# EAGLE design UART_Block (EAGLE 6.6.0)

## Sheet 1 of 2
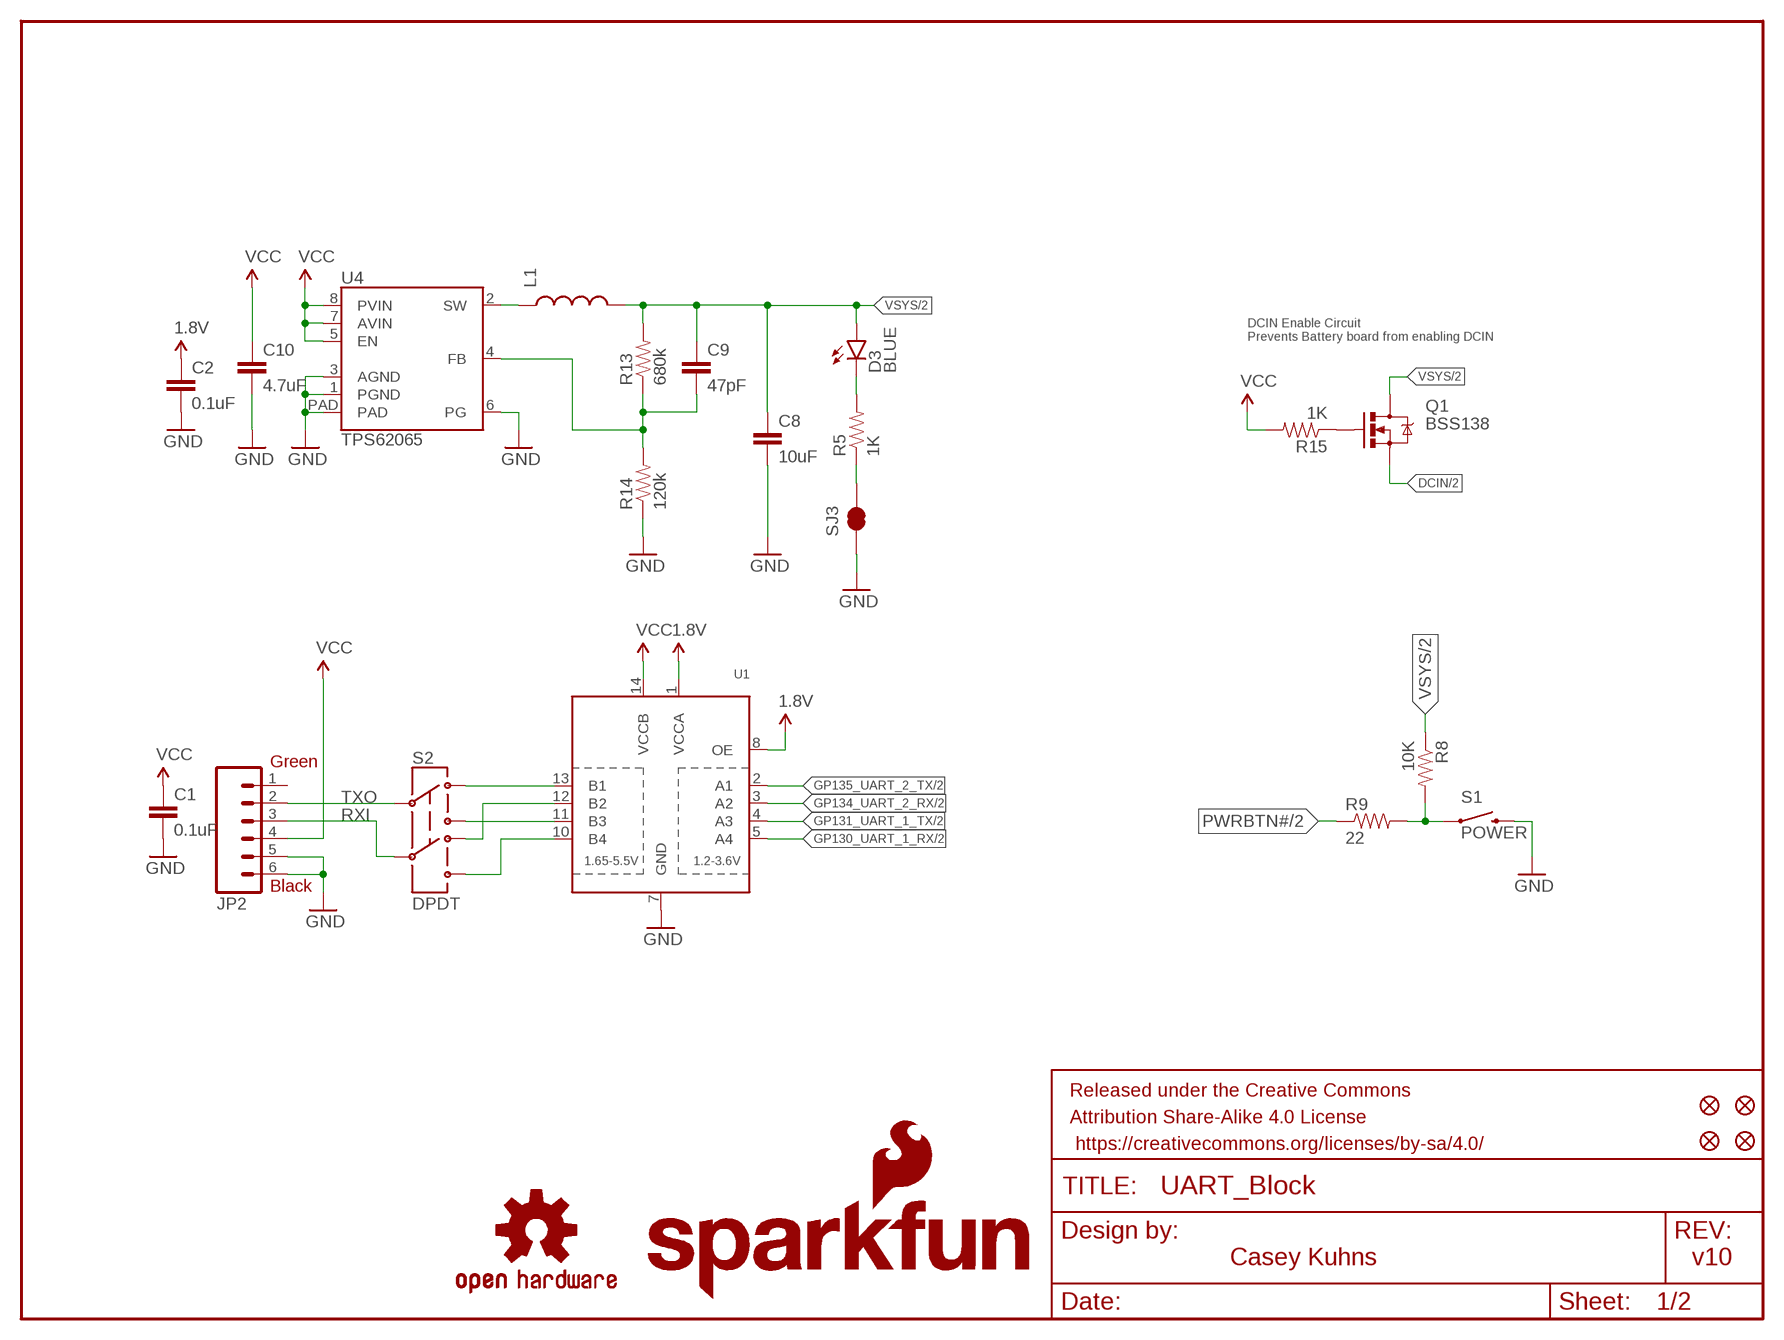
[diagram p0: schematic, sheet 1]

### Parts
C1  0.1uF  0.1UF-25V(+80/-20%)(0603)  [0603-CAP]
C2  0.1uF  0.1UF-25V(+80/-20%)(0603)  [0603-CAP]
C8  10uF  10UF-6.3V-20%(1206)  [1206]
C9  47pF  47PF-50V-5%(0603)  [0603-CAP]
C10  4.7uF  4.7UF-6.3V-10%(0603)0603  [0603-CAP]
D3  BLUE  LED-BLUE0603  [LED-0603]
FID1  FIDUCIAL1X2  [FIDUCIAL-1X2]
FID2  FIDUCIAL1X2  [FIDUCIAL-1X2]
FID3  FIDUCIAL1X2  [FIDUCIAL-1X2]
FID4  FIDUCIAL1X2  [FIDUCIAL-1X2]
FRAME1  FRAME-LETTER  [CREATIVE_COMMONS]
JP2  M06SMD  [1X06-SMD]
L1  INDUCTOR  [INDUCTOR-SRP4020]
LOGO1  SFE_LOGO_NAME_FLAME.1_INCH  [SFE_LOGO_NAME_FLAME_.1]
LOGO4  OSHW-LOGOS  [OSHW-LOGO-S]
Q1  BSS138  MOSFET-NCHANNELBSS138  [SOT23-3]
R5  1K  1KOHM1/10W1%(0603)  [0603-RES]
R8  10K  10KOHM1/10W1%(0603)0603  [0603-RES]
R9  22  22OHM1/10W1%(0603)  [0603-RES]
R13  680k  RESISTOR0603  [0603-RES]
R14  120k  RESISTOR0603  [0603-RES]
R15  1K  1KOHM1/10W1%(0603)  [0603-RES]
S1  POWER  SWITCH-MOMENTARY-2TACTILE-SWITCH-SMD-RIGHT-ANGLE  [TACTILE_SWITCH-SMD-RIGHT-ANGLE]
S2  DPDT  SWITCH-DPDTAYZ0202  [AYZ0202]
SJ3  JUMPER-PAD-2-NC_BY_TRACE  [PAD-JUMPER-2-NC_BY_TRACE_YES_SILK]
U1  TXB0104PWRSOIC14  [SO14]
U4  TPS62065  [WSON-8-PAD]

### Nets
1.8V: C2.1 U1.1(VCCA) U1.8(OE) ; also sheet 2
DCIN: Q1.2(S) ; also sheet 2
GND: C1.2 C2.2 C8.2 C10.2 JP2.5 JP2.6 R14.1 S1.2 SJ3.1 U1.7(GND) U4.1(PGND) U4.3(AGND) U4.6(PG) U4.PAD ; also sheet 2
GP130_UART_1_RX: U1.5(A4) ; also sheet 2
GP131_UART_1_TX: U1.4(A3) ; also sheet 2
GP134_UART_2_RX: U1.3(A2) ; also sheet 2
GP135_UART_2_TX: U1.2(A1) ; also sheet 2
N$1: Q1.1(G) R15.1
N$12: D3.C R5.2
N$13: R5.1 SJ3.2
N$15: R8.2 R9.2 S1.1
N$18: C9.2 R13.1 R14.2 U4.4(FB)
N$19: L1.P$1 U4.2(SW)
PWRBTN#: R9.1 ; also sheet 2
RXI: JP2.3 S2.5
TXO: JP2.2 S2.2
UART1RX: S2.6 U1.10(B4)
UART1TX: S2.3 U1.11(B3)
UART2RX: S2.4 U1.12(B2)
UART2TX: S2.1 U1.13(B1)
VCC: C1.1 C10.1 JP2.4 R15.2 U1.14(VCCB) U4.5(EN) U4.7(AVIN) U4.8(PVIN)
VSYS: C8.1 C9.1 D3.A L1.P$2 Q1.3(D) R8.1 R13.2 ; also sheet 2
Unconnected: JP2.1

### Notes on the sheet
- DCIN Enable Circuit
  Prevents Battery board from enabling DCIN
- Green
- Black
- Casey Kuhns | v10

## Sheet 2 of 2
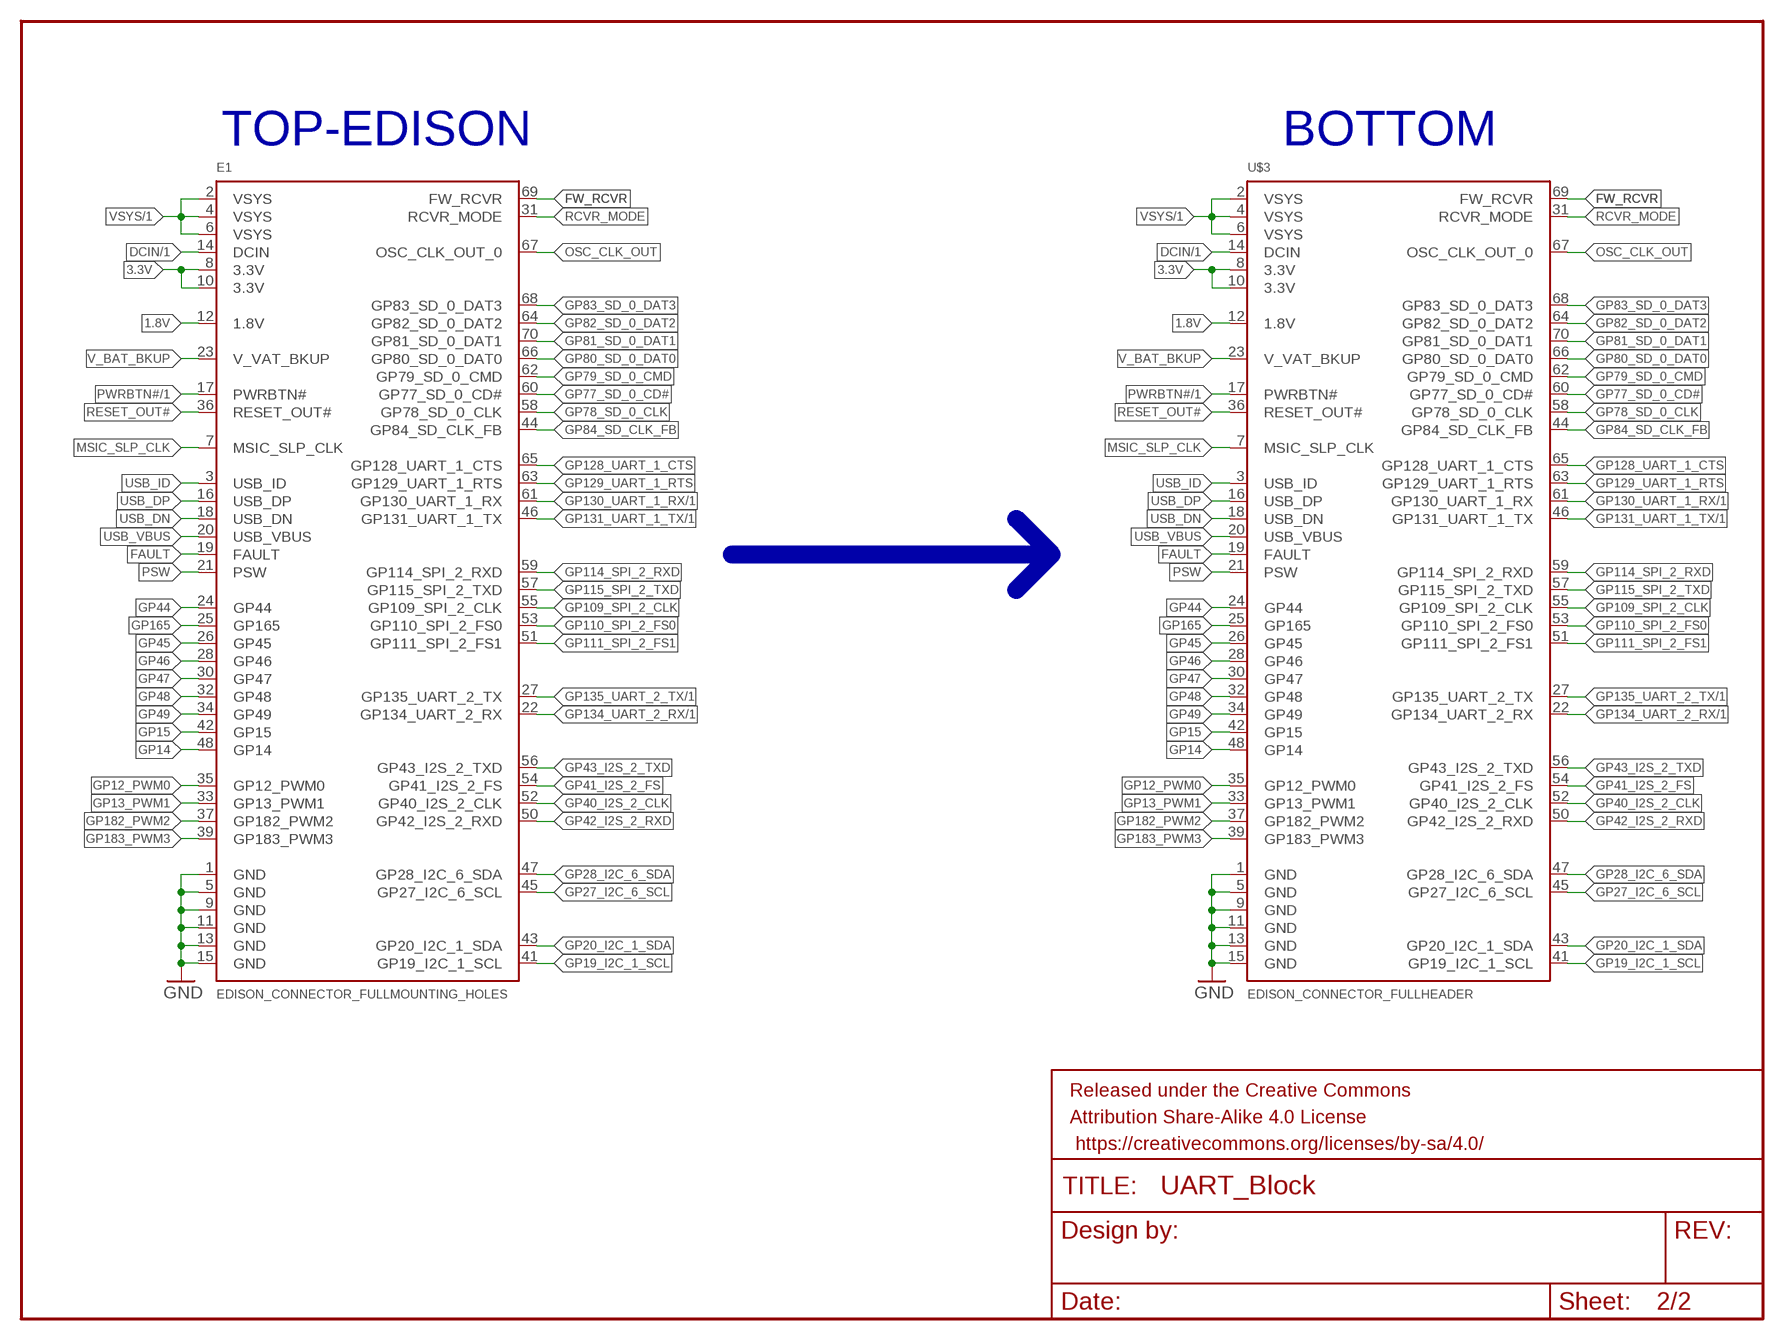
[diagram p1: schematic, sheet 2]

### Parts
E1  EDISON_CONNECTOR_FULLMOUNTING_HOLES  [EDISON_DAUGHTER]
FRAME2  FRAME-LETTER  [CREATIVE_COMMONS]
U$3  EDISON_CONNECTOR_FULLHEADER  [DF40C-70DP-0.4(51)]

### Nets
1.8V: E1.12(1.8V) U$3.12(1.8V) ; also sheet 1
3.3V: E1.8(3.3V) E1.10(3.3V) U$3.8(3.3V) U$3.10(3.3V)
DCIN: E1.14(DCIN) U$3.14(DCIN) ; also sheet 1
FAULT: E1.19(FAULT) U$3.19(FAULT)
FW_RCVR: E1.69(FW_RCVR) U$3.69(FW_RCVR)
GND: E1.1(GND) E1.5(GND) E1.9(GND) E1.11(GND) E1.13(GND) E1.15(GND) U$3.1(GND) U$3.5(GND) U$3.9(GND) U$3.11(GND) U$3.13(GND) U$3.15(GND) ; also sheet 1
GP12_PWM0: E1.35(GP12_PWM0) U$3.35(GP12_PWM0)
GP13_PWM1: E1.33(GP13_PWM1) U$3.33(GP13_PWM1)
GP14: E1.48(GP14) U$3.48(GP14)
GP15: E1.42(GP15) U$3.42(GP15)
GP19_I2C_1_SCL: E1.41(GP19_I2C_1_SCL) U$3.41(GP19_I2C_1_SCL)
GP20_I2C_1_SDA: E1.43(GP20_I2C_1_SDA) U$3.43(GP20_I2C_1_SDA)
GP27_I2C_6_SCL: E1.45(GP27_I2C_6_SCL) U$3.45(GP27_I2C_6_SCL)
GP28_I2C_6_SDA: E1.47(GP28_I2C_6_SDA) U$3.47(GP28_I2C_6_SDA)
GP40_I2S_2_CLK: E1.52(GP40_I2S_2_CLK) U$3.52(GP40_I2S_2_CLK)
GP41_I2S_2_FS: E1.54(GP41_I2S_2_FS) U$3.54(GP41_I2S_2_FS)
GP42_I2S_2_RXD: E1.50(GP42_I2S_2_RXD) U$3.50(GP42_I2S_2_RXD)
GP43_I2S_2_TXD: E1.56(GP43_I2S_2_TXD) U$3.56(GP43_I2S_2_TXD)
GP44: E1.24(GP44) U$3.24(GP44)
GP45: E1.26(GP45) U$3.26(GP45)
GP46: E1.28(GP46) U$3.28(GP46)
GP47: E1.30(GP47) U$3.30(GP47)
GP48: E1.32(GP48) U$3.32(GP48)
GP49: E1.34(GP49) U$3.34(GP49)
GP77_SD_0_CD#: E1.60(GP77_SD_0_CD#) U$3.60(GP77_SD_0_CD#)
GP78_SD_0_CLK: E1.58(GP78_SD_0_CLK) U$3.58(GP78_SD_0_CLK)
GP79_SD_0_CMD: E1.62(GP79_SD_0_CMD) U$3.62(GP79_SD_0_CMD)
GP80_SD_0_DAT0: E1.66(GP80_SD_0_DAT0) U$3.66(GP80_SD_0_DAT0)
GP81_SD_0_DAT1: E1.70(GP81_SD_0_DAT1) U$3.70(GP81_SD_0_DAT1)
GP82_SD_0_DAT2: E1.64(GP82_SD_0_DAT2) U$3.64(GP82_SD_0_DAT2)
GP83_SD_0_DAT3: E1.68(GP83_SD_0_DAT3) U$3.68(GP83_SD_0_DAT3)
GP84_SD_CLK_FB: E1.44(GP84_SD_CLK_FB) U$3.44(GP84_SD_CLK_FB)
GP109_SPI_2_CLK: E1.55(GP109_SPI_2_CLK) U$3.55(GP109_SPI_2_CLK)
GP110_SPI_2_FS0: E1.53(GP110_SPI_2_FS0) U$3.53(GP110_SPI_2_FS0)
GP111_SPI_2_FS1: E1.51(GP111_SPI_2_FS1) U$3.51(GP111_SPI_2_FS1)
GP114_SPI_2_RXD: E1.59(GP114_SPI_2_RXD) U$3.59(GP114_SPI_2_RXD)
GP115_SPI_2_TXD: E1.57(GP115_SPI_2_TXD) U$3.57(GP115_SPI_2_TXD)
GP128_UART_1_CTS: E1.65(GP128_UART_1_CTS) U$3.65(GP128_UART_1_CTS)
GP129_UART_1_RTS: E1.63(GP129_UART_1_RTS) U$3.63(GP129_UART_1_RTS)
GP130_UART_1_RX: E1.61(GP130_UART_1_RX) U$3.61(GP130_UART_1_RX) ; also sheet 1
GP131_UART_1_TX: E1.46(GP131_UART_1_TX) U$3.46(GP131_UART_1_TX) ; also sheet 1
GP134_UART_2_RX: E1.22(GP134_UART_2_RX) U$3.22(GP134_UART_2_RX) ; also sheet 1
GP135_UART_2_TX: E1.27(GP135_UART_2_TX) U$3.27(GP135_UART_2_TX) ; also sheet 1
GP165: E1.25(GP165) U$3.25(GP165)
GP182_PWM2: E1.37(GP182_PWM2) U$3.37(GP182_PWM2)
GP183_PWM3: E1.39(GP183_PWM3) U$3.39(GP183_PWM3)
MSIC_SLP_CLK: E1.7(MSIC_SLP_CLK) U$3.7(MSIC_SLP_CLK)
OSC_CLK_OUT: E1.67(OSC_CLK_OUT_0) U$3.67(OSC_CLK_OUT_0)
PSW: E1.21(PSW) U$3.21(PSW)
PWRBTN#: E1.17(PWRBTN#) U$3.17(PWRBTN#) ; also sheet 1
RCVR_MODE: E1.31(RCVR_MODE) U$3.31(RCVR_MODE)
RESET_OUT#: E1.36(RESET_OUT#) U$3.36(RESET_OUT#)
USB_DN: E1.18(USB_DN) U$3.18(USB_DN)
USB_DP: E1.16(USB_DP) U$3.16(USB_DP)
USB_ID: E1.3(USB_ID) U$3.3(USB_ID)
USB_VBUS: E1.20(USB_VBUS) U$3.20(USB_VBUS)
V_BAT_BKUP: E1.23(V_VAT_BKUP) U$3.23(V_VAT_BKUP)
VSYS: E1.2(VSYS) E1.4(VSYS) E1.6(VSYS) U$3.2(VSYS) U$3.4(VSYS) U$3.6(VSYS) ; also sheet 1

### Buses
B$1

### Notes on the sheet
- TOP-EDISON | BOTTOM

## Library data of the parts
C1 C2 = SparkFun-Capacitors:0.1UF-25V(+80/-20%)(0603): CAP-00810 Ceramic Standard decoupling cap; PROD_ID: CAP-00810
C8 = SparkFun-Capacitors:10UF-6.3V-20%(1206): CAP-10057 Ceramic; PROD_ID: CAP-10057
C9 = SparkFun-Capacitors:47PF-50V-5%(0603): CAP-08913; PROD_ID: CAP-08913
C10 = SparkFun-Capacitors:4.7UF-6.3V-10%(0603): CAP-08280; PROD_ID: CAP-08280
D3 = SparkFun-LED:LED-BLUE: Blue LEDs for production use Various blue LEDs stocked by SparkFun production 0603 - DIO-08575 Rebel - DIO-09553 1206 - DIO-09911; PROD_ID: DIO-08575
E1 U$3 = Edison:EDISON_CONNECTOR_FULL
FID1-FID4 = SparkFun-Aesthetics:FIDUCIAL: Fiducial Alignment Points Various fiducial points for machine vision alignment.
FRAME1 FRAME2 = SparkFun-Aesthetics:FRAME-LETTER: Schematic Frame Standard 8.5x11 US Letter frame
JP2 = SparkFun-Connectors:M06: Header 6 Standard 6-pin 0.1" header. Use with straight break away headers (SKU : PRT-00116), right angle break away headers (PRT-00553), swiss pins (PRT-00743), machine pins (PRT-00117), and female headers (PRT-00115). Molex polarized connector foot print use with SKU : PRT-08094 with associated crimp pins and housings. NOTES ON THE VARIANTS LOCK and LOCK_LONGPADS... This footprint was designed to help hold the alignment of a through-hole component (i.e. 6-pin header) while soldering it into place. You may notice that each hole has been shifted either up or down by 0.005 of an inch from it's more standard position (which is a perfectly straight line). This slight alteration caused the pins (the squares in the middle) to touch the edges of the holes. Because they are alternating, it causes a "brace" to hold the component in place. 0.005 has proven to be the perfect amount of "off-center" position when using our standard breakaway headers. Although looks a little odd when you look at the bare footprint, once you have a header in there, the alteration is very hard to notice. Also,if you push a header all the way into place, it is covered up entirely on the bottom side. This idea of altering the position of holes to aid alignment will be further integrated into the Sparkfun Library for other footprints. It can help hold any component with 3 or more connection pins.
L1 = SparkFun-Passives:INDUCTOR: Inductors Basic Inductor/Choke - 0603 and 1206. Footprints are not proven and vary greatly between part numbers. SRN6045- 33uH, 20% 1.4A SDR0403-560KL - 56uH, 10%, 500mA RMS/740mA peak
LOGO1 = SparkFun-Aesthetics:SFE_LOGO_NAME_FLAME: SFE Logo, name and flame This is the SparkFun full logo. The logo on the schematic will always be the same size; the package variant is the height of the flame part of the logo. Default layer for the logo on the board is tSilk.
LOGO4 = SparkFun-Aesthetics:OSHW-LOGO: Open Source Hardware Logo This logo indicates the piece of hardware it is found on incorporates a OSHW license and/or adheres to the definition of open source hardware found here: http://freedomdefined.org/OSHW
Q1 = SparkFun-DiscreteSemi:MOSFET-NCHANNEL: Common NMOSFET Parts MFG P/N Store ID Prod ID FDD8780 TRANS-09984 SI7820DN TRANS-11055 FDS6630A IC-08089 2N7002PW TRANS-11151 FQP30N06L COM-10213 TRANS-10060 BSS123LT1G TRANS-08345 BSS138 TRANS-00830 BS170 2N7000; PROD_ID: TRANS-00830
R5 R15 = SparkFun-Resistors:1KOHM1/10W1%(0603): RES-07856; PROD_ID: RES-07856
R8 = SparkFun-Resistors:10KOHM1/10W1%(0603): RES-00824; PROD_ID: RES-00824
R9 = SparkFun-Resistors:22OHM1/10W1%(0603): RES-08698; PROD_ID: RES-08698
R13 R14 = SparkFun-Resistors:RESISTOR: Resistor Basic schematic elements and footprints for 0603, 1206, and PTH resistors.
S1 = SparkFun-Electromechanical:SWITCH-MOMENTARY-2: Various NO switches- pushbuttons, reed, etc; PROD_ID: COMP-12265
S2 = SparkFun-Electromechanical:SWITCH-DPDT: DPDT Version of the COM-00597; PROD_ID: SWCH-08179
SJ3 = SparkFun-Passives:JUMPER-PAD-2-NC_BY_TRACE
U1 = SparkFun-DigitalIC:TXB0104PWR: 4-Bit Bi-Directional Level Shifter 1.2V-3.6V (VCCA) to 1.65V-5.5V (VCCB) bi-directional level shifter with auto direction sensing. Max data rate - VCCA 1.8V: 20Mbps (50ns), VCCA 3.3V: 100Mbps (10ns) Digikey: 296-21929-1-ND (TSSOP) IC-11329; PROD_ID: IC-11329
U4 = Testing:TPS62065: Texas Instruments TPS62172 3-17V 0.5A Step-Down Converter with DCS control. Available in adjustable and fixed output voltage versions. Is packaged in an 8-pin WSON package measuring 2 × 2 mm (DSG). See a 3.3V fixed output version of this chip in action on the Electric Imp Breakout Board <https://www.sparkfun.com/products/11400>. Datasheet <http://www.ti.com/lit/gpn/tps62172>

## Board
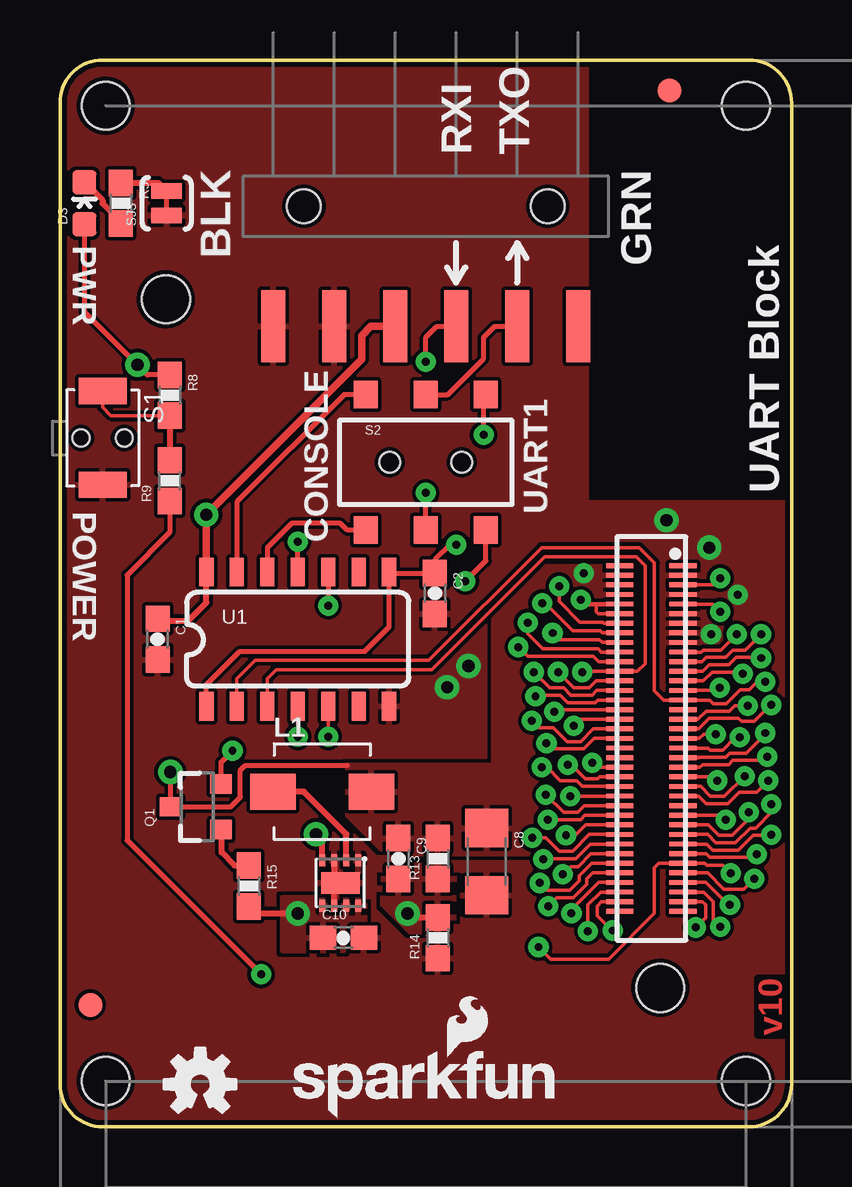
[diagram p2: board, top side]
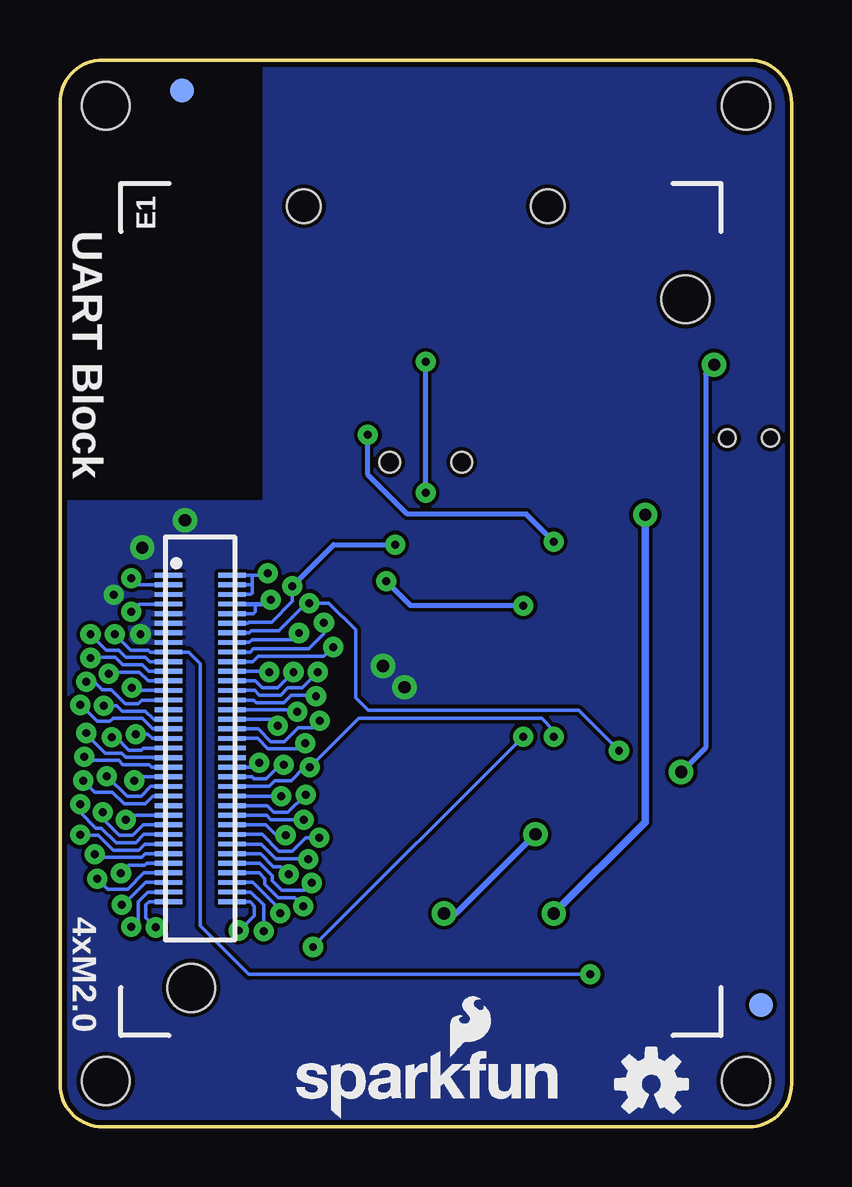
[diagram p3: board, bottom side, seen from below]

Size 30.48 x 44.45 mm. Coordinates in mm from the lower left corner, seen from the top.
Outline: 30.48,42.67 30.48,1.78 arc-90 28.7,0 1.78,0 arc-90 0,1.78 0,42.67 arc-90 1.78,44.45 28.7,44.45 arc-90 30.48,42.67
Copper layers (1*16): Top 0.035mm / dielectric 1.5mm / Bottom 0.035mm
Design rules "SparkFun-2-layer *": minimum track width 6mil, minimum drill 13mil, track to track 6mil, track to pad 6mil, pad to pad 6mil, via to via 6mil, smd to smd 6mil, copper to edge 8mil, drill to drill 8mil, minimum pad ring 12mil, minimum via ring 10mil, stop-mask expansion 4mil, vias tented up to drill 20mil, thermal gap 6mil
Holes 2 mm at 28.57,1.91 1.91,1.91 1.91,42.55 28.57,42.55
tRestrict: area 22.1,26.2 to 30.5,44.5; 3 lines
bRestrict: area 22.1,26.2 to 30.5,44.5

### Footprints (pad centres in the part's own frame; a part is rotated, then mirrored left to right if it is on the bottom)
0603-CAP = smd 1.1 x 1: 1 -0.85,0; 2 0.85,0
1206 = smd 1.6 x 1.8: 1 -1.4,0; 2 1.4,0
LED-0603 = smd 1 x 1: A 0,-0.877; C 0,0.877
EDISON_DAUGHTER = smd 1.14 x 0.2: 1 1.98,19.17; 2 4.62,19.17; 3 1.98,18.77; 4 4.62,18.77; 5 1.98,18.37; 6 4.62,18.37; 7 1.98,17.97; 8 4.62,17.97; 9 1.98,17.57; 10 4.62,17.57; 11 1.98,17.17; 12 4.62,17.17; 13 1.98,16.77; 14 4.62,16.77; 15 1.98,16.37; 16 4.62,16.37; 17 1.98,15.97; 18 4.62,15.97; 19 1.98,15.57; 20 4.62,15.57; 21 1.98,15.17; 22 4.62,15.17; 23 1.98,14.77; 24 4.62,14.77; 25 1.98,14.37; 26 4.62,14.37; 27 1.98,13.97; 28 4.62,13.97; 29 1.98,13.57; 30 4.62,13.57; 31 1.98,13.17; 32 4.62,13.17; 33 1.98,12.77; 34 4.62,12.77; 35 1.98,12.37; 36 4.62,12.37; 37 1.98,11.97; 38 4.62,11.97; 39 1.98,11.57; 40 4.62,11.57; 41 1.98,11.17; 42 4.62,11.17; 43 1.98,10.77; 44 4.62,10.77; 45 1.98,10.37; 46 4.62,10.37; 47 1.98,9.97; 48 4.62,9.97; 49 1.98,9.57; 50 4.62,9.57; 51 1.98,9.17; 52 4.62,9.17; 53 1.98,8.77; 54 4.62,8.77; 55 1.98,8.37; 56 4.62,8.37; 57 1.98,7.97; 58 4.62,7.97; 59 1.98,7.57; 60 4.62,7.57; 61 1.98,7.17; 62 4.62,7.17; 63 1.98,6.77; 64 4.62,6.77; 65 1.98,6.37; 66 4.62,6.37; 67 1.98,5.97; 68 4.62,5.97; 69 1.98,5.57; 70 4.62,5.57 | hole 2: 23.53,30.67; 2.93,1.98
FIDUCIAL-1X2 = smd 1 x 1: 1 0,0
1X06-SMD = smd 1 x 3: 1 -6.35,5; 2 -3.81,5; 3 -1.27,5; 4 1.27,5; 5 3.81,5; 6 6.35,5 | hole 1.4: -5.08,0; 5.08,0
INDUCTOR-SRP4020 = smd 1.9 x 1.5: P$1 -2.05,0; P$2 2.05,0
SOT23-3 = smd 0.8 x 0.9: 1 -0.95,-1; 2 0.95,-1; 3 0,1.1
0603-RES = smd 1.1 x 1: 1 -0.85,0; 2 0.85,0
TACTILE_SWITCH-SMD-RIGHT-ANGLE = smd 1.1 x 2: 1 -1.95,0; 2 1.95,0 | hole 0.7: 0,0.9; 0,-0.9
AYZ0202 = smd 1 x 1.15: 1 -2.5,2.825; 2 0,2.825; 3 2.5,2.825; 4 -2.5,-2.825; 5 0,-2.825; 6 2.5,-2.825 | hole 0.85: 1.5,0; -1.5,0
PAD-JUMPER-2-NC_BY_TRACE_YES_SILK = smd 0.635 x 1.27: 1 -0.508,0; 2 0.508,0
SO14 = smd 0.6 x 1.2: 1 -3.81,-2.8; 2 -2.54,-2.8; 3 -1.27,-2.8; 4 0,-2.8; 5 1.27,-2.8; 6 2.54,-2.8; 7 3.81,-2.8; 8 3.81,2.8; 9 2.54,2.8; 10 1.27,2.8; 11 0,2.8; 12 -1.27,2.8; 13 -2.54,2.8; 14 -3.81,2.8
WSON-8-PAD = smd 0.25 x 0.5: 1 -0.75,-0.95; 2 -0.25,-0.95; 3 0.25,-0.95; 4 0.75,-0.95; 5 0.75,0.95; 6 0.25,0.95; 7 -0.25,0.95; 8 -0.75,0.95 | smd 1.6 x 0.9: PAD 0,0
DF40C-70DP-0.4(51) = smd 0.2 x 1.14 bottom: 1 6.8,1.32; 2 6.8,-1.32; 3 6.4,1.32; 4 6.4,-1.32; 5 6,1.32; 6 6,-1.32; 7 5.6,1.32; 8 5.6,-1.32; 9 5.2,1.32; 10 5.2,-1.32; 11 4.8,1.32; 12 4.8,-1.32; 13 4.4,1.32; 14 4.4,-1.32; 15 4,1.32; 16 4,-1.32; 17 3.6,1.32; 18 3.6,-1.32; 19 3.2,1.32; 20 3.2,-1.32; 21 2.8,1.32; 22 2.8,-1.32; 23 2.4,1.32; 24 2.4,-1.32; 25 2,1.32; 26 2,-1.32; 27 1.6,1.32; 28 1.6,-1.32; 29 1.2,1.32; 30 1.2,-1.32; 31 0.8,1.32; 32 0.8,-1.32; 33 0.4,1.32; 34 0.4,-1.32; 35 0,1.32; 36 0,-1.32; 37 -0.4,1.32; 38 -0.4,-1.32; 39 -0.8,1.32; 40 -0.8,-1.32; 41 -1.2,1.32; 42 -1.2,-1.32; 43 -1.6,1.32; 44 -1.6,-1.32; 45 -2,1.32; 46 -2,-1.32; 47 -2.4,1.32; 48 -2.4,-1.32; 49 -2.8,1.32; 50 -2.8,-1.32; 51 -3.2,1.32; 52 -3.2,-1.32; 53 -3.6,1.32; 54 -3.6,-1.32; 55 -4,1.32; 56 -4,-1.32; 57 -4.4,1.32; 58 -4.4,-1.32; 59 -4.8,1.32; 60 -4.8,-1.32; 61 -5.2,1.32; 62 -5.2,-1.32; 63 -5.6,1.32; 64 -5.6,-1.32; 65 -6,1.32; 66 -6,-1.32; 67 -6.4,1.32; 68 -6.4,-1.32; 69 -6.8,1.32; 70 -6.8,-1.32; NC1 7.2,1.32; NC2 7.2,-1.32; NC3 -7.2,-1.32; NC4 -7.2,1.32

### Placement (x,y rotation side)
C1  4.06,20.32 270 top
C2  15.62,22.23 270 top
C8  17.78,11.05 270 top
C9  14.1,11.18 270 top
C10  11.81,7.87 0 top
D3  1.02,38.48 0 top
E1  27.94,3.81 0 bottom
FID1  25.4,43.18 0 top
FID2  1.27,5.08 0 top
FID3  1.27,5.08 0 bottom
FID4  25.4,43.18 0 bottom
FRAME1  -1.27,-13.97 0 top  (outside the outline)
FRAME2  -1.27,-13.97 0 top  (outside the outline)
JP2  15.24,38.35 180 top
L1  10.92,13.97 0 top
LOGO1  9.27,0.25 0 top
LOGO2  OSHW-LOGOS  [OSHW-LOGO-S]  5.84,1.78 0 bottom
LOGO3  SFE_LOGO_NAME_FLAME.1_INCH  [SFE_LOGO_NAME_FLAME_.1]  21.08,0.25 0 bottom
LOGO4  5.84,1.78 0 top
Q1  5.71,13.34 90 top
R5  2.54,38.48 270 top
R8  4.57,30.48 270 top
R9  4.57,26.92 90 top
R13  15.75,11.18 90 top
R14  15.75,7.87 90 top
R15  7.87,10.03 270 top
S1  1.78,28.7 270 top
S2  15.24,27.69 0 top
SJ3  4.45,38.48 90 top
U1  9.91,20.32 0 top
U4  11.68,10.16 180 top
U$3  24.64,16.18 90 bottom

### Tracks (layer width: path | path; a pad name or v marks a point on that pad's centre or on a via)
1.8V  (via drill 0.33)
  Top 0.152: U$3.12 22.66,20.98 22.61,21.03 21.67,21.03 20.8,21.89 v20.8,22.53
  Top 0.203: U1.1 6.1,18.41 7.49,19.81 12.7,19.81 13.72,20.83 U1.8 13.76,23.07 C2.1 15.62,23.62 16.26,24.26 v16.51,24.26
  Bottom 0.152: U$3.12 | v20.8,22.53 20.8,21.89 21.67,21.03 22.61,21.03 22.66,20.98 U$3.12
  Bottom 0.203: v16.51,24.26 19.07,24.26 v20.8,22.53
3.3V  (via drill 0.33)
  Top 0.152: U$3.10 22.43,21.38 22.35,21.46 22.35,21.78
  Top 0.178: v21.7,21.96 21.88,21.78 22.35,21.78 U$3.8
  Bottom 0.152: U$3.10 22.43,21.38 22.35,21.46 22.35,21.78 | U$3.8
  Bottom 0.178: U$3.8 22.35,21.78 21.88,21.78 v21.7,21.96
DCIN  (via drill 0.33)
  Top 0.152: E1.14 22.6,20.58 22.5,20.68 21.36,20.68 20.22,21.82 v20.09,21.82
  Top 0.203: Q1.2 6.71,15.2 v7.19,15.67
  Bottom 0.152: E1.14 22.6,20.58 22.5,20.68 21.36,20.68 20.22,21.82 v20.09,21.82 19.28,21.82 18.16,20.7 18.16,17.88 17.63,17.35 8.87,17.35 v7.19,15.67
FAULT  (via drill 0.33)
  Top 0.152: U$3.19 26.75,19.38 26.92,19.56 27.74,19.56 28.04,19.86 28.55,19.86 v29.21,20.52
  Bottom 0.152: v29.21,20.52 28.55,19.86 28.04,19.86 27.74,19.56 26.92,19.56 26.75,19.38 U$3.19
FW_RCVR  (via drill 0.33)
  Top 0.152: v26.49,8.31 26.9,8.71 26.9,9.25 26.76,9.38 U$3.69
  Bottom 0.152: U$3.69 26.76,9.38 26.9,9.25 26.9,8.71 v26.49,8.31
GND  (via drill 0.33, 0.51)
  Top 0.254: U4.6 11.43,9.91 U4.PAD 11.43,10.16 U4.3
  other vias: 27.13,20.52 28.24,22.17 27.05,24.13 25.27,25.27 17.02,19.2 16.13,18.31
  pour Bottom (isolate 0.051, rank 6): 30.48,42.67 30.48,1.78 arc-90 28.7,0 1.78,0 arc-90 0,1.78 0,42.67 arc-90 1.78,44.45 28.7,44.45 arc-90
  pour Top (isolate 0.051, rank 6): 30.48,1.73 arc-90 28.75,0 1.78,0 arc-90 0,1.78 0,42.67 arc-90 1.78,44.45 28.7,44.45 arc-90 30.48,42.67
GP12_PWM0  (via drill 0.33)
  Top 0.152: U$3.35 26.64,16.18 26.82,16.36 v27.33,16.36
  Bottom 0.152: v27.33,16.36 26.82,16.36 26.64,16.18 U$3.35 | U$3.35
GP13_PWM1  (via drill 0.33)
  Top 0.152: v29.64,17.58 29.62,17.58 28.93,16.89 28.4,16.89 28.27,17.02 27.05,17.02 26.61,16.58 U$3.33
  Bottom 0.152: U$3.33 26.61,16.58 27.05,17.02 28.27,17.02 28.4,16.89 28.93,16.89 29.62,17.58 v29.64,17.58
GP14  (via drill 0.33)
  Top 0.152: v21.26,13.77 21.27,13.78 U$3.48
  Bottom 0.152: U$3.48 21.27,13.78 v21.26,13.77
GP15  (via drill 0.33)
  Top 0.152: U$3.42 22.36,14.98 v22.17,15.16
  Bottom 0.152: v22.17,15.16 22.36,14.98 U$3.42
GP19_I2C_1_SCL  (via drill 0.33)
  Top 0.152: U$3.41 26.66,14.98 26.77,15.09 27.86,15.09 28.04,15.27 29.31,15.27 v29.46,15.42
  Bottom 0.152: v29.46,15.42 29.31,15.27 28.04,15.27 27.86,15.09 26.77,15.09 26.66,14.98 U$3.41
GP20_I2C_1_SDA  (via drill 0.33)
  Top 0.152: U$3.43 27.23,14.58 v27.38,14.43
  Bottom 0.152: v27.38,14.43 27.23,14.58 U$3.43 | U$3.43
GP27_I2C_6_SCL  (via drill 0.33)
  Top 0.152: v28.52,14.61 27.69,13.77 27.1,13.77 26.69,14.18 U$3.45
  Bottom 0.152: U$3.45 26.69,14.18 27.1,13.77 27.69,13.77 v28.52,14.61
GP28_I2C_6_SDA  (via drill 0.33)
  Top 0.152: U$3.47 26.61,13.78 26.92,13.46 27.81,13.46 28.3,13.95 29.03,13.95 v29.52,14.43
  Bottom 0.152: v29.52,14.43 29.03,13.95 28.3,13.95 27.81,13.46 26.92,13.46 26.61,13.78 U$3.47
GP40_I2S_2_CLK  (via drill 0.33)
  Top 0.152: U$3.52 21.87,12.98 21.69,12.8 v20.32,12.8
  Bottom 0.152: v20.32,12.8 21.69,12.8 21.87,12.98 U$3.52
GP41_I2S_2_FS  (via drill 0.33)
  Top 0.152: v21.08,12.14 21.46,12.14 21.9,12.58 U$3.54
  Bottom 0.152: U$3.54 21.9,12.58 21.46,12.14 v21.08,12.14
GP42_I2S_2_RXD  (via drill 0.33)
  Top 0.152: U$3.50 21.84,13.38 21.57,13.11 20.98,13.11 v20.24,13.84
  Bottom 0.152: v20.24,13.84 20.98,13.11 21.57,13.11 21.84,13.38 U$3.50
GP43_I2S_2_TXD  (via drill 0.33)
  Top 0.152: U$3.56 22.06,12.18 21.36,11.48 20.8,11.48 20.24,12.04 v19.68,12.04
  Bottom 0.152: v19.68,12.04 20.24,12.04 20.8,11.48 21.36,11.48 22.06,12.18 U$3.56
GP44  (via drill 0.33)
  Top 0.152: U$3.24 22.34,18.58 22.05,18.29 21.41,18.29 v20.75,18.95
  Bottom 0.152: v20.75,18.95 21.41,18.29 22.05,18.29 22.34,18.58 U$3.24
GP45  (via drill 0.33)
  Top 0.152: v19.74,18.95 20.4,18.29 20.98,18.29 21.29,17.98 22.17,17.98 22.37,18.18 U$3.26
  Bottom 0.152: U$3.26 22.37,18.18 22.17,17.98 21.29,17.98 20.98,18.29 20.4,18.29 v19.74,18.95
GP46  (via drill 0.33)
  Top 0.152: U$3.28 22.4,17.78 22.3,17.68 21.16,17.68 20.85,17.98 19.86,17.98 v19.81,17.93
  Bottom 0.152: v19.81,17.93 19.86,17.98 20.85,17.98 21.16,17.68 22.3,17.68 22.4,17.78 U$3.28
GP47  (via drill 0.33)
  Top 0.152: U$3.30 22.43,17.38 22.43,17.37 20.68,17.37 v20.6,17.3
  Bottom 0.152: v20.6,17.3 20.68,17.37 22.43,17.37 22.43,17.38 U$3.30
GP48  (via drill 0.33)
  Top 0.152: v21.41,16.71 21.68,16.98 U$3.32
  Bottom 0.152: U$3.32 21.68,16.98 v21.41,16.71
GP49  (via drill 0.33)
  Top 0.152: U$3.34 22.22,16.58 21.69,16.05 21.13,16.05 20.55,16.64 19.94,16.64 v19.66,16.92
  Bottom 0.152: v19.66,16.92 19.94,16.64 20.55,16.64 21.13,16.05 21.69,16.05 22.22,16.58 U$3.34
GP77_SD_0_CD#  (via drill 0.33)
  Top 0.152: U$3.60 22.12,11.38 21.59,10.85 21.29,10.85 v20.95,10.52
  Bottom 0.152: v20.95,10.52 21.29,10.85 21.59,10.85 22.12,11.38 U$3.60
GP78_SD_0_CLK  (via drill 0.33)
  Top 0.152: U$3.58 22.09,11.78 21.49,11.18 20.17,11.18 v20.14,11.15
  Bottom 0.152: v20.14,11.15 20.17,11.18 21.49,11.18 22.09,11.78 U$3.58
GP79_SD_0_CMD  (via drill 0.33)
  Top 0.152: U$3.62 22.16,10.98 21.64,10.46 21.64,10.26 21.23,9.86 20.3,9.86 v19.99,10.16
  Bottom 0.152: v19.99,10.16 20.3,9.86 21.23,9.86 21.64,10.26 21.64,10.46 22.16,10.98 U$3.62
GP80_SD_0_DAT0  (via drill 0.33)
  Top 0.152: v21.31,8.89 21.31,9.04 22.45,10.18 U$3.66
  Bottom 0.152: U$3.66 22.45,10.18 21.31,9.04 v21.31,8.89
GP81_SD_0_DAT1  (via drill 0.33)
  Top 0.152: U$3.70 22.56,9.38 22.38,9.2 22.38,8.79 22.99,8.18 v23.04,8.18
  Bottom 0.152: v23.04,8.18 22.99,8.18 22.38,8.79 22.38,9.2 22.56,9.38 U$3.70
GP82_SD_0_DAT2  (via drill 0.33)
  Top 0.152: U$3.64 22.19,10.58 21.95,10.34 21.95,10.11 21.39,9.55 20.7,9.55 v20.34,9.2
  Bottom 0.152: v20.34,9.2 20.7,9.55 21.39,9.55 21.95,10.11 21.95,10.34 22.19,10.58 U$3.64
GP83_SD_0_DAT3  (via drill 0.33)
  Top 0.152: v22,8.15 22,9.25 22.53,9.78 U$3.68
  Bottom 0.152: U$3.68 22.53,9.78 22,9.25 v22,8.15
GP84_SD_CLK_FB  (via drill 0.33)
  Top 0.152: U$3.44 22.48,14.58 22.4,14.5 21.89,14.5 21.31,15.09 v21.16,15.09
  Bottom 0.152: v21.16,15.09 21.31,15.09 21.89,14.5 22.4,14.5 22.48,14.58 U$3.44 | U$3.44
GP109_SPI_2_CLK  (via drill 0.33)
  Top 0.152: U$3.55 26.99,12.18 27.33,11.84 28.14,11.84 28.75,12.45 28.98,12.45 29.64,13.11 v29.64,13.44
  Bottom 0.152: v29.64,13.44 29.64,13.11 28.98,12.45 28.75,12.45 28.14,11.84 27.33,11.84 26.99,12.18 U$3.55
GP110_SPI_2_FS0  (via drill 0.33)
  Top 0.152: v28.7,13.11 28.7,12.83 28.02,12.14 27.46,12.14 27.02,12.58 U$3.53
  Bottom 0.152: U$3.53 27.02,12.58 27.46,12.14 28.02,12.14 28.7,12.83 v28.7,13.11
GP111_SPI_2_FS1  (via drill 0.33)
  Top 0.152: v27.74,12.8 27.56,12.98 U$3.51
  Bottom 0.152: U$3.51 27.56,12.98 v27.74,12.8
GP114_SPI_2_RXD  (via drill 0.33)
  Top 0.152: U$3.59 26.92,11.38 27.08,11.23 28.91,11.23 v29.03,11.35
  Bottom 0.152: U$3.59 26.92,11.38 27.08,11.23 28.91,11.23 v29.03,11.35
GP115_SPI_2_TXD  (via drill 0.33)
  Top 0.152: U$3.57 26.95,11.78 27.2,11.53 28.27,11.53 28.88,12.14 29.62,12.14 v29.64,12.17
  Bottom 0.152: U$3.57 26.95,11.78 27.2,11.53 28.27,11.53 28.88,12.14 29.62,12.14 v29.64,12.17
GP128_UART_1_CTS  (via drill 0.33)
  Top 0.152: U$3.65 26.9,10.18 27.84,9.25 v27.91,9.25
  Bottom 0.152: v27.91,9.25 27.84,9.25 26.9,10.18 U$3.65
GP129_UART_1_RTS  (via drill 0.33)
  Top 0.152: v28.93,10.34 28.5,9.91 27.66,9.91 26.99,10.58 U$3.63
  Bottom 0.152: U$3.63 26.99,10.58 27.66,9.91 28.5,9.91 v28.93,10.34
GP130_UART_1_RX  (via drill 0.33)
  Top 0.152: v27.94,10.57 27.61,10.9 26.95,10.9 26.87,10.98 U$3.61 24.95,10.98 24.77,10.79 24.77,8.89 22.86,6.99 20.45,6.99 v19.94,7.49 | v11.18,16.26 U1.5
  Bottom 0.152: U$3.61 26.87,10.98 26.95,10.9 27.61,10.9 v27.94,10.57 | v19.94,7.49 v11.18,16.26
GP131_UART_1_TX  (via drill 0.33)
  Top 0.152: U$3.46 22.52,14.18 22.5,14.2 21.77,14.2 21.54,14.43 20.85,14.43 20.3,14.99 v20.07,14.99 | v9.91,16.26 U1.4
  Bottom 0.152: U$3.46 22.52,14.18 22.5,14.2 21.77,14.2 21.54,14.43 20.85,14.43 20.3,14.99 v20.07,14.99 18.03,17.02 10.41,17.02 9.91,16.51 v9.91,16.26
GP134_UART_2_RX  (via drill 0.33)
  Top 0.152: v21.77,18.95 21.8,18.98 U$3.22 24.06,18.98 24.38,19.3 24.38,23.37 24,23.75 20.19,23.75 15.49,19.05 9.02,19.05 8.64,18.67 U1.3
  Bottom 0.152: U$3.22 21.8,18.98 v21.77,18.95
GP135_UART_2_TX  (via drill 0.33)
  Top 0.152: v29.39,18.54 29.06,18.54 28.73,18.21 28.35,18.21 27.76,17.63 27.23,17.63 27.08,17.78 U$3.27 25.15,17.78 24.77,18.16 24.77,23.5 24.13,24.13 20.07,24.13 15.37,19.43 8.13,19.43 7.37,18.67 U1.2
  Bottom 0.152: U$3.27 27.08,17.78 27.23,17.63 27.76,17.63 28.35,18.21 28.73,18.21 29.06,18.54 v29.39,18.54
GP165  (via drill 0.33)
  Top 0.152: v27.48,18.29 27.38,18.18 U$3.25
  Bottom 0.152: U$3.25 27.38,18.18 v27.48,18.29
GP182_PWM2  (via drill 0.33)
  Top 0.152: U$3.37 27.02,15.78 27.1,15.7 27.61,15.7 28.14,16.23 v28.32,16.23
  Bottom 0.152: v28.32,16.23 28.14,16.23 27.61,15.7 27.1,15.7 27.02,15.78 U$3.37
GP183_PWM3  (via drill 0.33)
  Top 0.152: v29.39,16.41 29.39,16.36 28.6,15.57 27.91,15.57 27.74,15.39 26.62,15.39 26.61,15.38 U$3.39
  Bottom 0.152: U$3.39 26.61,15.38 26.62,15.39 27.74,15.39 27.91,15.57 28.6,15.57 29.39,16.36 v29.39,16.41
MSIC_SLP_CLK  (via drill 0.33)
  Top 0.152: v27.51,21.46 27.19,21.78 U$3.7
  Bottom 0.152: U$3.7 27.19,21.78 v27.51,21.46
N$1
  Top 0.254: R15.1 7.28,10.88 6.73,11.43 6.73,12.37 Q1.1
N$12
  Top 0.254: D3.C 1.78,38.6 1.78,38.48 2.54,37.72 R5.2
N$13
  Top 0.254: R5.1 4.1,39.33 SJ3.2
N$15
  Top 0.152: S1.1 1.78,29.97 2.12,29.63 R8.2
  Top 0.254: R8.2 R9.2
N$18  (via drill 0.51)
  Top 0.254: U4.4 10.93,11.93 v10.67,12.19 | v14.48,8.89 14.64,8.72 R14.2
  Bottom 0.254: v14.48,8.89 13.97,8.89 v10.67,12.19
  pour Top: 16.41,10.9 16.38,8.13 14.61,8.13 13.46,9.27 13.49,10.9
N$19
  Top 0.254: U4.2 11.93,12.2 10.16,13.97 L1.P$1
OSC_CLK_OUT  (via drill 0.33)
  Top 0.152: v27.51,8.33 27.23,8.61 27.23,9.37 26.82,9.78 U$3.67
  Bottom 0.152: U$3.67 26.82,9.78 27.23,9.37 27.23,8.61 v27.51,8.33
PSW  (via drill 0.33)
  Top 0.152: v29.21,19.53 29.18,19.56 28.17,19.56 27.86,19.25 27.05,19.25 26.78,18.98 U$3.21
  Bottom 0.152: U$3.21 26.78,18.98 27.05,19.25 27.86,19.25 28.17,19.56 29.18,19.56 v29.21,19.53
PWRBTN#  (via drill 0.33)
  Top 0.152: v28.19,20.52 27.53,19.86 26.8,19.86 26.71,19.78 U$3.17
  Top 0.203: R9.1 4.57,24.77 2.79,22.99 2.79,11.94 v8.38,6.35
  Bottom 0.152: v28.19,20.52 27.53,19.86 26.8,19.86 26.71,19.78 U$3.17 25.11,19.78 24.64,19.3 24.64,8.38 22.61,6.35 v8.38,6.35
RCVR_MODE  (via drill 0.33)
  Top 0.152: v28.65,17.55 28.12,17.55 27.89,17.32 26.92,17.32 26.58,16.98 U$3.31
  Bottom 0.152: U$3.31 26.58,16.98 26.92,17.32 27.89,17.32 28.12,17.55 v28.65,17.55
RESET_OUT#  (via drill 0.33)
  Top 0.152: U$3.36 22.25,16.18 21.82,15.75 20.5,15.75 v20.27,15.98
  Bottom 0.152: v20.27,15.98 20.5,15.75 21.82,15.75 22.25,16.18 U$3.36
RXI  (via drill 0.33)
  Top 0.203: S2.5 v15.24,26.42 | v15.24,31.88 15.24,32.89 15.7,33.35 JP2.3
  Bottom 0.203: v15.24,26.42 v15.24,31.88
TXO
  Top 0.203: S2.2 16.16,30.51 17.65,32 17.65,32.89 18.11,33.35 JP2.2
UART1RX  (via drill 0.33)
  Top 0.203: U1.10 v11.18,21.72 | v16.89,22.73 17.74,23.58 S2.6
  Bottom 0.203: v11.18,21.72 15.88,21.72 v16.89,22.73
UART1TX  (via drill 0.33)
  Top 0.203: U1.11 v9.91,24.38 | v17.65,28.83 17.65,30.42 S2.3
  Bottom 0.203: v9.91,24.38 11.05,25.53 16,25.53 17.65,27.18 v17.65,28.83
UART2RX
  Top 0.203: S2.4 11.97,24.86 11.68,25.15 9.65,25.15 8.64,24.13 U1.12
UART2TX
  Top 0.203: S2.1 11.84,30.51 7.37,26.04 U1.13
USB_DN  (via drill 0.33)
  Top 0.152: U$3.18 22.56,19.78 22.43,19.91 20.12,19.91 19.48,20.55 v19.48,21.01
  Bottom 0.152: v19.48,21.01 19.48,20.55 20.12,19.91 22.43,19.91 22.56,19.78 U$3.18
USB_DP  (via drill 0.33)
  Top 0.152: v20.52,20.57 20.8,20.3 22.48,20.3 22.59,20.18 U$3.16
  Bottom 0.152: U$3.16 22.59,20.18 22.48,20.3 20.8,20.3 v20.52,20.57
USB_ID  (via drill 0.33)
  Top 0.152: v27.51,22.86 27.23,22.58 U$3.3
  Bottom 0.152: U$3.3 27.23,22.58 v27.51,22.86
USB_VBUS  (via drill 0.33)
  Top 0.152: v19.1,19.99 19.48,19.61 22.23,19.61 22.45,19.38 U$3.20
  Bottom 0.152: U$3.20 22.45,19.38 22.23,19.61 19.48,19.61 v19.1,19.99
V_BAT_BKUP  (via drill 0.33)
  Top 0.152: v28.45,18.87 28.37,18.95 27.18,18.95 26.81,18.58 U$3.23
  Bottom 0.152: U$3.23 26.81,18.58 27.18,18.95 28.37,18.95 v28.45,18.87
VCC  (via drill 0.51)
  Top 0.254: C1.1 4.06,21.08 5.33,21.08 6.1,21.84 U1.14 | R15.2 8.17,8.89 v9.91,8.89
  Top 0.305: U1.14 v6.1,25.5 12.57,31.98 12.57,32.97 12.95,33.35 JP2.4
  Bottom 0.305: v6.1,25.5 6.1,12.7 v9.91,8.89
  pour Top: 9.27,7.37 11.81,7.37 11.81,8.51 12.7,8.51 12.7,9.53 11.68,9.53 11.68,8.76 11.18,8.76 11.18,9.53 9.27,9.53
VSYS  (via drill 0.33, 0.51)
  Top 0.203: 11.99,15.06 7.72,15.06 7.52,14.86 7.52,13.74 7.11,13.34 Q1.3 4.6,13.35 v4.6,14.78 | D3.A 1.02,33.96 v3.23,31.75 3.65,31.33 R8.1
  Bottom 0.152: U$3.2 22.48,22.98 | 22.48,22.98 21.91,22.98 v21.83,23.06 | 22.48,22.61 22.5,22.58 U$3.4 | 22.48,22.61 22.48,22.98 | 22.48,22.61 22.48,22.23 22.52,22.18 U$3.6
  Bottom 0.203: v3.23,31.75 3.58,31.39 3.58,15.8 v4.6,14.78
  pour Top (isolate 0.051): 20.45,21.84 23.75,21.84 23.75,23.37 20.07,23.37 18.03,21.34 18.03,15.11 11.94,15.11 11.94,12.95 13.56,11.33 20.07,11.33 19.68,21.08

### Text on the board
Top: v10
tPlace: RXI | TXO | BLK | GRN | PWR | CONSOLE | UART1 | POWER | UART Block
bPlace: UART Block | 4xM2.0
tDocu: NOTE: Units are in Inches | Casey Kuhns